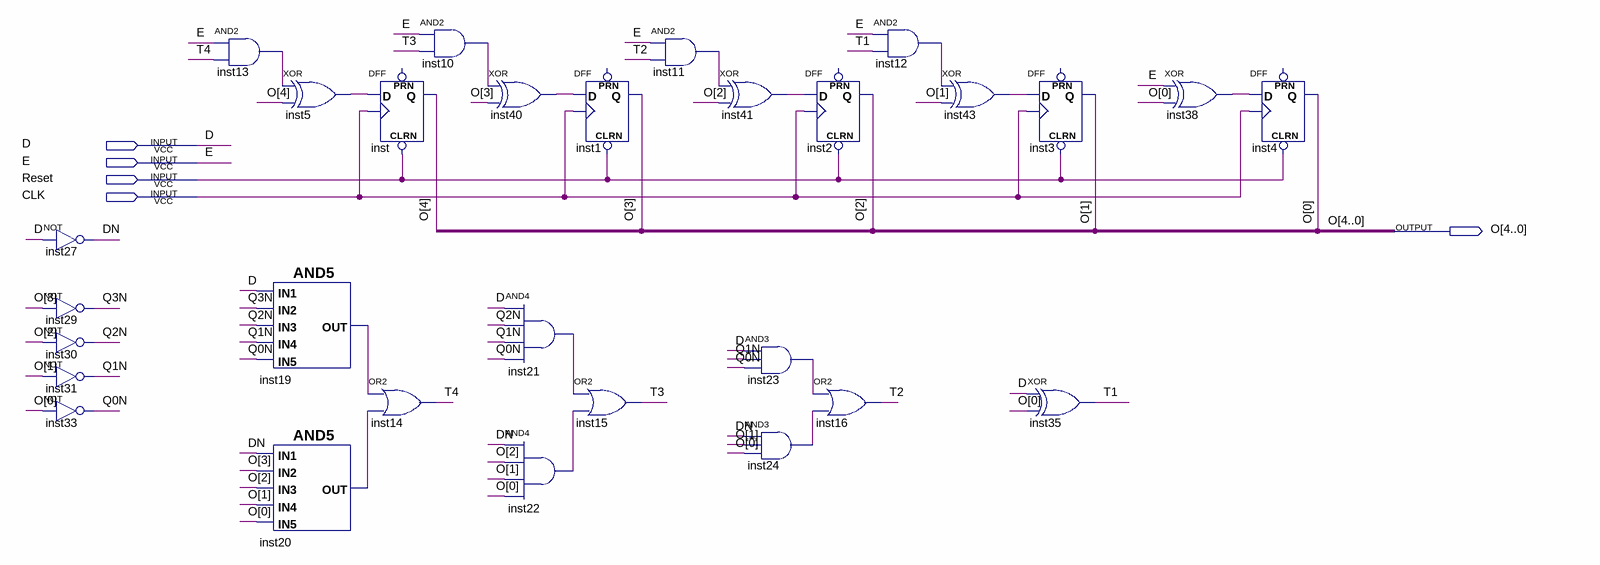
[diagram p0: schematic sheet]
// Quartus schematic TOP.bdf as structural Verilog: 29 symbols, 5 pins
module TOP (
  input  D,
  input  E,
  input  Reset,
  input  CLK,
  output [4:0] O
);

  wire DN, inst5_out, inst10_out, inst11_out, inst12_out, inst13_out, inst19_out, inst20_out, inst21_out,
       inst22_out, inst23_out, inst24_out, inst38_out, inst40_out, inst41_out, inst43_out, Q0N, Q1N, Q2N,
       Q3N, T1, T2, T3, T4;

  not inst27 (DN, D);
  not inst29 (Q3N, O[3]);
  not inst30 (Q2N, O[2]);
  not inst31 (Q1N, O[1]);
  not inst33 (Q0N, O[0]);
  and inst13 (inst13_out, E, T4);
  xor inst5 (inst5_out, inst13_out, O[4]);
  and inst19 (inst19_out, D, Q3N, Q2N, Q1N, Q0N);
  and inst20 (inst20_out, DN, O[3], O[2], O[1], O[0]);
  and inst10 (inst10_out, E, T3);
  DFF inst (.CLRN(Reset), .CLK(CLK), .D(inst5_out), .Q(O[4]));  // open: PRN
  or inst14 (T4, inst19_out, inst20_out);
  xor inst40 (inst40_out, inst10_out, O[3]);
  and inst21 (inst21_out, D, Q2N, Q1N, Q0N);
  and inst22 (inst22_out, DN, O[2], O[1], O[0]);
  DFF inst1 (.CLRN(Reset), .CLK(CLK), .D(inst40_out), .Q(O[3]));  // open: PRN
  or inst15 (T3, inst21_out, inst22_out);
  and inst11 (inst11_out, E, T2);
  xor inst41 (inst41_out, inst11_out, O[2]);
  and inst23 (inst23_out, D, Q1N, Q0N);
  and inst24 (inst24_out, DN, O[1], O[0]);
  DFF inst2 (.CLRN(Reset), .CLK(CLK), .D(inst41_out), .Q(O[2]));  // open: PRN
  or inst16 (T2, inst23_out, inst24_out);
  and inst12 (inst12_out, E, T1);
  xor inst43 (inst43_out, inst12_out, O[1]);
  DFF inst3 (.CLRN(Reset), .CLK(CLK), .D(inst43_out), .Q(O[1]));  // open: PRN
  xor inst35 (T1, D, O[0]);
  xor inst38 (inst38_out, E, O[0]);
  DFF inst4 (.CLRN(Reset), .CLK(CLK), .D(inst38_out), .Q(O[0]));  // open: PRN
endmodule
